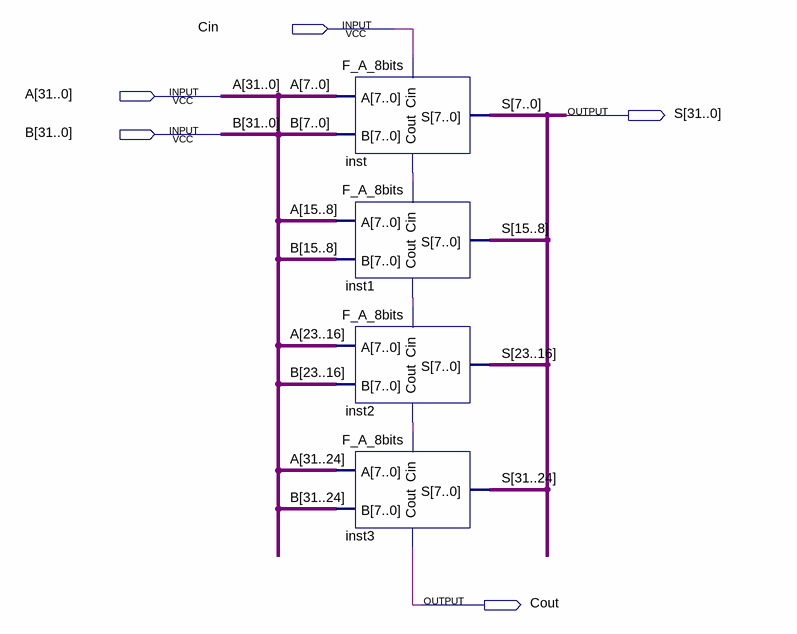
[diagram p0: schematic sheet]
// Quartus schematic F_A_32bits.bdf as structural Verilog: 4 symbols, 5 pins
module F_A_32bits (
  input  Cin,
  input  [31:0] A,
  input  [31:0] B,
  output [31:0] S,
  output Cout
);

  wire inst1_cout, inst2_cout, inst_cout;

  F_A_8bits inst (.Cin(Cin), .A(A[7:0]), .B(B[7:0]), .S(S[7:0]), .Cout(inst_cout));
  F_A_8bits inst1 (.Cin(inst_cout), .A(A[15:8]), .B(B[15:8]), .S(S[15:8]), .Cout(inst1_cout));
  F_A_8bits inst2 (.Cin(inst1_cout), .A(A[23:16]), .B(B[23:16]), .S(S[23:16]), .Cout(inst2_cout));
  F_A_8bits inst3 (.Cin(inst2_cout), .A(A[31:24]), .B(B[31:24]), .S(S[31:24]), .Cout(Cout));
endmodule
